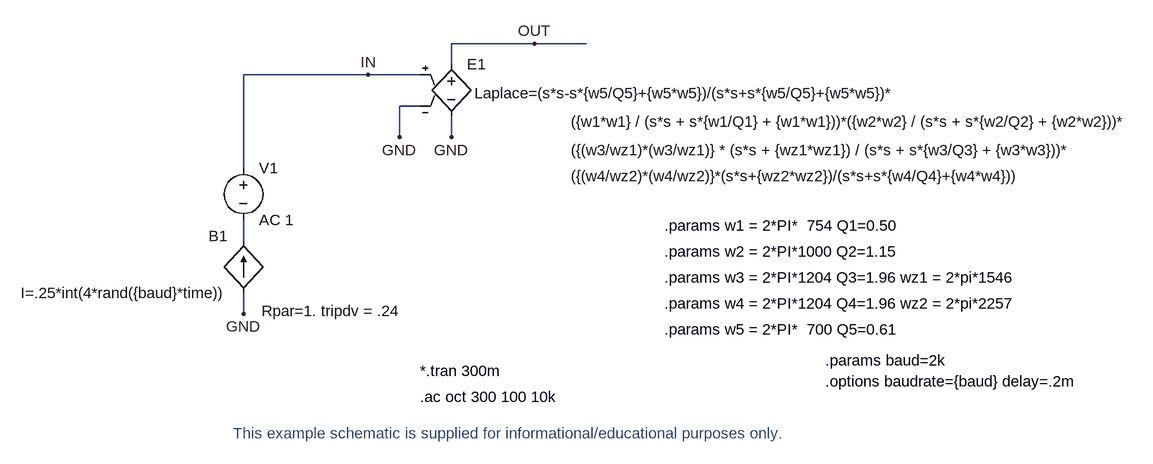
[diagram p0: schematic EyeDiagramAC.asc]
EyeDiagramAC.asc, the LTspice schematic file:
Version 4
SHEET 1 1800 688
WIRE 336 -288 336 -432
WIRE 336 -96 336 -64
WIRE 336 -176 336 -208
WIRE 656 -368 656 -336
WIRE 608 -384 576 -384
WIRE 576 -384 576 -336
WIRE 656 -448 656 -480
WIRE 656 -480 784 -480
WIRE 608 -432 528 -432
WIRE 528 -432 336 -432
WIRE 784 -480 864 -480
FLAG 336 -64 GND
FLAG 656 -336 GND
FLAG 576 -336 GND
FLAG 528 -432 IN
FLAG 784 -480 OUT
SYMBOL bi 336 -96 R180
WINDOW 0 24 88 Left 0
WINDOW 3 24 0 Left 0
WINDOW 39 -28 -28 Right 0
SYMATTR InstName B1
SYMATTR Value I=.25*int(4*rand({baud}*time))
SYMATTR SpiceLine Rpar=1. tripdv = .24
SYMBOL voltage 336 -304 R0
SYMATTR InstName V1
SYMATTR Value AC 1
SYMBOL e 656 -464 R0
WINDOW 3 184 104 Left 0
WINDOW 38 36 60 Left 0
WINDOW 39 184 148 Left 0
WINDOW 40 184 188 Left 0
SYMATTR InstName E1
SYMATTR Value ({w1*w1} / (s*s + s*{w1/Q1} + {w1*w1}))*({w2*w2} / (s*s + s*{w2/Q2} + {w2*w2}))*
SYMATTR SpiceModel Laplace=(s*s-s*{w5/Q5}+{w5*w5})/(s*s+s*{w5/Q5}+{w5*w5})*
SYMATTR SpiceLine ({(w3/wz1)*(w3/wz1)} * (s*s + {wz1*wz1}) / (s*s + s*{w3/Q3} + {w3*w3}))*
SYMATTR SpiceLine2 ({(w4/wz2)*(w4/wz2)}*(s*s+{wz2*wz2})/(s*s+s*{w4/Q4}+{w4*w4}))
TEXT 608 64 Left 0 !.ac oct 300 100 10k
TEXT 984 -160 Left 0 !.params w2 = 2*PI*1000 Q2=1.15
TEXT 984 -120 Left 0 !.params w3 = 2*PI*1204 Q3=1.96 wz1 = 2*pi*1546
TEXT 984 -80 Left 0 !.params w4 = 2*PI*1204 Q4=1.96 wz2 = 2*pi*2257
TEXT 984 -40 Left 0 !.params w5 = 2*PI*  700 Q5=0.61
TEXT 1232 40 Left 0 !.options baudrate={baud} delay=.2m
TEXT 1232 8 Left 0 !.params baud=2k
TEXT 608 24 Left 0 !*.tran 300m
TEXT 984 -200 Left 0 !.params w1 = 2*PI*  754 Q1=0.50
text 320 120 Left 0 ;This example schematic is supplied for informational/educational purposes only.

The netlist it stands for:
* EyeDiagramAC.asc
B1 GND N001 I=.25*int(4*rand({baud}*time)) Rpar=1. tripdv = .24
V1 IN N001 AC 1
E1 OUT GND IN GND Laplace=(s*s-s*{w5/Q5}+{w5*w5})/(s*s+s*{w5/Q5}+{w5*w5})* ({w1*w1} / (s*s + s*{w1/Q1} + {w1*w1}))*({w2*w2} / (s*s + s*{w2/Q2} + {w2*w2}))* ({(w3/wz1)*(w3/wz1)} * (s*s + {wz1*wz1}) / (s*s + s*{w3/Q3} + {w3*w3}))* ({(w4/wz2)*(w4/wz2)}*(s*s+{wz2*wz2})/(s*s+s*{w4/Q4}+{w4*w4}))
.ac oct 300 100 10k
.params w2 = 2*PI*1000 Q2=1.15
.params w3 = 2*PI*1204 Q3=1.96 wz1 = 2*pi*1546
.params w4 = 2*PI*1204 Q4=1.96 wz2 = 2*pi*2257
.params w5 = 2*PI*  700 Q5=0.61
.options baudrate={baud} delay=.2m
.params baud=2k
*.tran 300m
.params w1 = 2*PI*  754 Q1=0.50
* This example schematic is supplied for informational/educational purposes only.
.backanno
.end